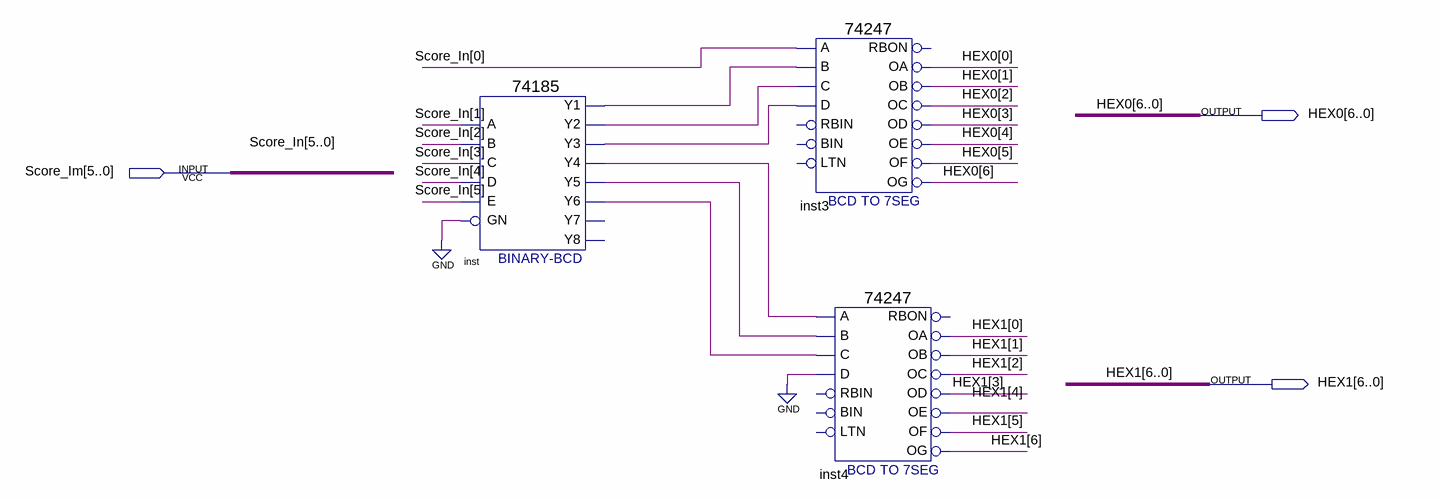
[diagram p0: schematic sheet]
// Quartus schematic DisplayScore.bdf as structural Verilog: 3 symbols, 3 pins
module DisplayScore (
  input  [5:0] Score_Im,
  output [6:0] HEX0,
  output [6:0] HEX1
);

  wire inst_y1, inst_y2, inst_y3, inst_y4, inst_y5, inst_y6;

  \74185  inst (
    .A(Score_Im[1]), .B(Score_Im[2]), .D(Score_Im[4]), .C(Score_Im[3]), .E(Score_Im[5]), .GN(1'b0),
    .Y1(inst_y1), .Y3(inst_y3), .Y2(inst_y2), .Y5(inst_y5), .Y4(inst_y4), .Y6(inst_y6));  // open: Y8, Y7
  \74247  inst3 (
    .A(Score_Im[0]), .B(inst_y1), .C(inst_y2), .D(inst_y3), .OF(HEX0[5]), .OC(HEX0[2]), .OD(HEX0[3]),
    .OE(HEX0[4]), .OA(HEX0[0]), .OB(HEX0[1]), .OG(HEX0[6]));  // open: LTN, BIN, RBIN, RBON
  \74247  inst4 (
    .A(inst_y4), .B(inst_y5), .C(inst_y6), .D(1'b0), .OF(HEX1[5]), .OC(HEX1[2]), .OD(HEX1[3]), .OE(HEX1[4]),
    .OA(HEX1[0]), .OB(HEX1[1]), .OG(HEX1[6]));  // open: LTN, BIN, RBIN, RBON

  // Other names for the same wires on the sheet: Score_In[5:0] = Score_Im
endmodule
